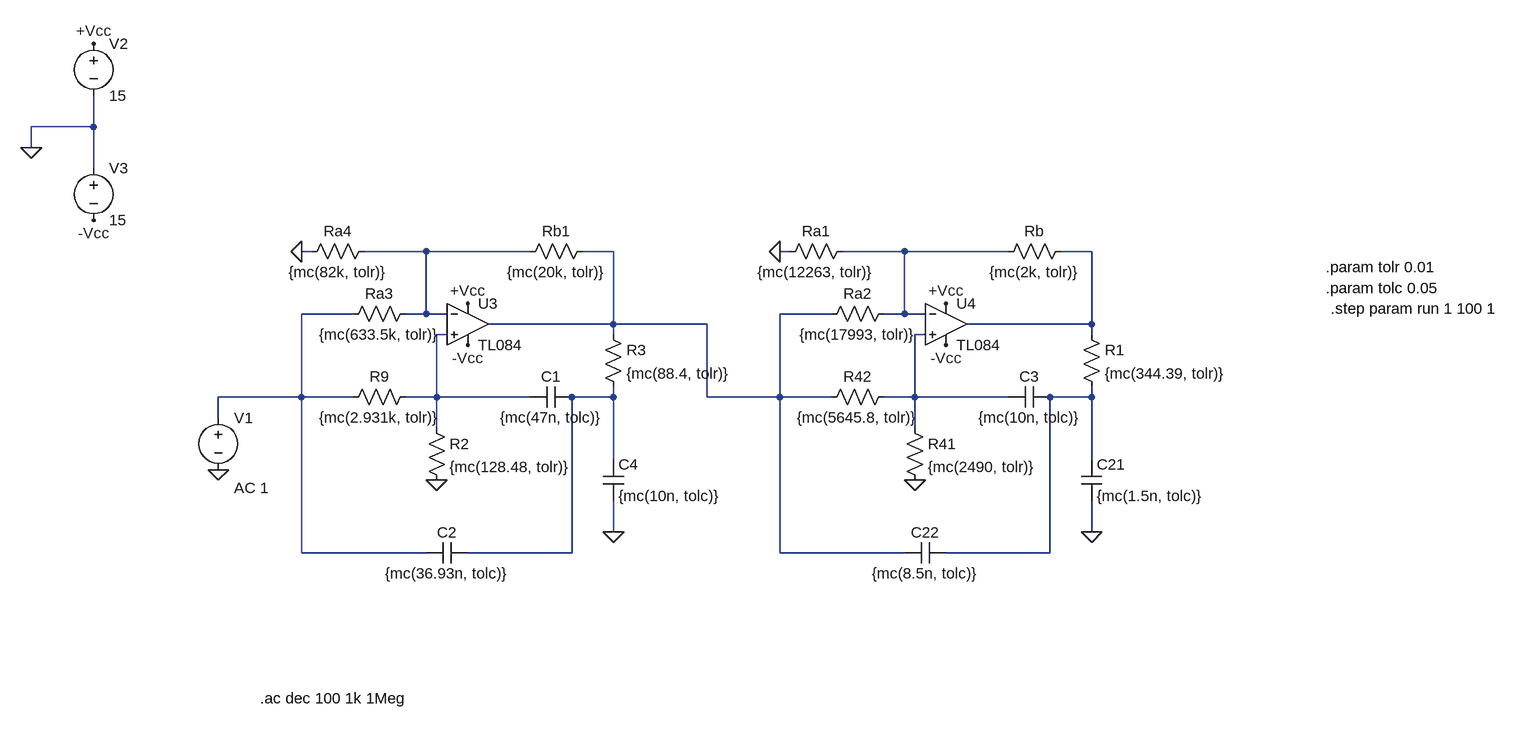
[diagram p0: schematic Sedra_double_Montecarlo.asc]
Sedra_double_Montecarlo.asc, the LTspice schematic file:
Version 4
SHEET 1 1996 680
WIRE -192 -480 -192 -528
WIRE -192 -480 -288 -480
WIRE -288 -448 -288 -480
WIRE -192 -416 -192 -480
WIRE 144 -288 128 -288
WIRE 320 -288 224 -288
WIRE 480 -288 320 -288
WIRE 608 -288 560 -288
WIRE 880 -288 864 -288
WIRE 1056 -288 960 -288
WIRE 1216 -288 1056 -288
WIRE 1344 -288 1296 -288
WIRE 208 -192 128 -192
WIRE 320 -192 320 -288
WIRE 320 -192 288 -192
WIRE 352 -192 320 -192
WIRE 944 -192 864 -192
WIRE 1056 -192 1056 -288
WIRE 1056 -192 1024 -192
WIRE 1088 -192 1056 -192
WIRE 608 -176 608 -288
WIRE 608 -176 416 -176
WIRE 752 -176 608 -176
WIRE 1344 -176 1344 -288
WIRE 1344 -176 1152 -176
WIRE 352 -160 336 -160
WIRE 608 -160 608 -176
WIRE 1088 -160 1072 -160
WIRE 1344 -160 1344 -176
WIRE 128 -64 128 -192
WIRE 128 -64 0 -64
WIRE 208 -64 128 -64
WIRE 336 -64 336 -160
WIRE 336 -64 288 -64
WIRE 480 -64 336 -64
WIRE 608 -64 608 -80
WIRE 608 -64 544 -64
WIRE 752 -64 752 -176
WIRE 864 -64 864 -192
WIRE 864 -64 752 -64
WIRE 944 -64 864 -64
WIRE 1072 -64 1072 -160
WIRE 1072 -64 1024 -64
WIRE 1216 -64 1072 -64
WIRE 1344 -64 1344 -80
WIRE 1344 -64 1280 -64
WIRE 0 -32 0 -64
WIRE 336 -16 336 -64
WIRE 1072 -16 1072 -64
WIRE 608 32 608 -64
WIRE 1344 32 1344 -64
WIRE 608 144 608 96
WIRE 1344 144 1344 96
WIRE 128 176 128 -64
WIRE 320 176 128 176
WIRE 544 176 544 -64
WIRE 544 176 384 176
WIRE 864 176 864 -64
WIRE 1056 176 864 176
WIRE 1280 176 1280 -64
WIRE 1280 176 1120 176
FLAG 0 48 0
FLAG 1072 64 0
FLAG 864 -288 0
FLAG 1344 144 0
FLAG -288 -448 0
FLAG 1120 -208 +Vcc
FLAG 1120 -144 -Vcc
FLAG -192 -608 +Vcc
FLAG -192 -336 -Vcc
FLAG 336 64 0
FLAG 128 -288 0
FLAG 608 144 0
FLAG 384 -208 +Vcc
FLAG 384 -144 -Vcc
SYMBOL voltage 0 -48 R0
WINDOW 123 24 124 Left 2
WINDOW 39 0 0 Left 0
SYMATTR Value2 AC 1
SYMATTR InstName V1
SYMATTR Value ""
SYMBOL res 1040 -80 R90
WINDOW 0 0 56 VBottom 2
WINDOW 3 32 56 VTop 2
SYMATTR InstName R42
SYMATTR Value {mc(5645.8, tolr)}
SYMBOL res 1040 -208 R90
WINDOW 0 0 56 VBottom 2
WINDOW 3 32 56 VTop 2
SYMATTR InstName Ra2
SYMATTR Value {mc(17993, tolr)}
SYMBOL res 1056 -32 R0
SYMATTR InstName R41
SYMATTR Value {mc(2490, tolr)}
SYMBOL cap 1280 -80 R90
WINDOW 0 0 32 VBottom 2
WINDOW 3 32 32 VTop 2
SYMATTR InstName C3
SYMATTR Value {mc(10n, tolc)}
SYMBOL cap 1120 160 R90
WINDOW 0 0 32 VBottom 2
WINDOW 3 32 32 VTop 2
SYMATTR InstName C22
SYMATTR Value {mc(8.5n, tolc)}
SYMBOL res 976 -304 R90
WINDOW 0 0 56 VBottom 2
WINDOW 3 32 56 VTop 2
SYMATTR InstName Ra1
SYMATTR Value {mc(12263, tolr)}
SYMBOL res 1312 -304 R90
WINDOW 0 0 56 VBottom 2
WINDOW 3 32 56 VTop 2
SYMATTR InstName Rb
SYMATTR Value {mc(2k, tolr)}
SYMBOL cap 1328 32 R0
SYMATTR InstName C21
SYMATTR Value {mc(1.5n, tolc)}
SYMBOL voltage -192 -624 R0
WINDOW 123 0 0 Left 0
WINDOW 39 0 0 Left 0
SYMATTR InstName V2
SYMATTR Value 15
SYMBOL voltage -192 -432 R0
WINDOW 123 0 0 Left 0
WINDOW 39 0 0 Left 0
SYMATTR InstName V3
SYMATTR Value 15
SYMBOL res 304 -80 R90
WINDOW 0 0 56 VBottom 2
WINDOW 3 32 56 VTop 2
SYMATTR InstName R9
SYMATTR Value {mc(2.931k, tolr)}
SYMBOL res 304 -208 R90
WINDOW 0 0 56 VBottom 2
WINDOW 3 32 56 VTop 2
SYMATTR InstName Ra3
SYMATTR Value {mc(633.5k, tolr)}
SYMBOL res 320 -32 R0
SYMATTR InstName R2
SYMATTR Value {mc(128.48, tolr)}
SYMBOL cap 544 -80 R90
WINDOW 0 0 32 VBottom 2
WINDOW 3 32 32 VTop 2
SYMATTR InstName C1
SYMATTR Value {mc(47n, tolc)}
SYMBOL cap 384 160 R90
WINDOW 0 0 32 VBottom 2
WINDOW 3 32 32 VTop 2
SYMATTR InstName C2
SYMATTR Value {mc(36.93n, tolc)}
SYMBOL res 240 -304 R90
WINDOW 0 0 56 VBottom 2
WINDOW 3 32 56 VTop 2
SYMATTR InstName Ra4
SYMATTR Value {mc(82k, tolr)}
SYMBOL res 576 -304 R90
WINDOW 0 0 56 VBottom 2
WINDOW 3 32 56 VTop 2
SYMATTR InstName Rb1
SYMATTR Value {mc(20k, tolr)}
SYMBOL cap 592 32 R0
SYMATTR InstName C4
SYMATTR Value {mc(10n, tolc)}
SYMBOL res 1328 -176 R0
SYMATTR InstName R1
SYMATTR Value {mc(344.39, tolr)}
SYMBOL res 592 -176 R0
SYMATTR InstName R3
SYMATTR Value {mc(88.4, tolr)}
SYMBOL sympropio\\TL084 384 -240 R0
SYMATTR InstName U3
SYMBOL sympropio\\TL084 1120 -240 R0
SYMATTR InstName U4
TEXT 64 400 Left 2 !.ac dec 100 1k 1Meg
TEXT 1704 -264 Left 2 !.param tolr 0.01
TEXT 1704 -232 Left 2 !.param tolc 0.05
TEXT 1712 -200 Left 2 !.step param run 1 100 1

The netlist it stands for:
* Sedra_double_Montecarlo.asc
V1 N005 0 AC 1
R42 N007 N002 {mc(5645.8, tolr)}
Ra2 N003 N002 {mc(17993, tolr)}
R41 N007 0 {mc(2490, tolr)}
C3 N009 N007 {mc(10n, tolc)}
C22 N009 N002 {mc(8.5n, tolc)}
Ra1 N003 0 {mc(12263, tolr)}
Rb N004 N003 {mc(2k, tolr)}
C21 N009 0 {mc(1.5n, tolc)}
V2 +Vcc 0 15
V3 0 -Vcc 15
R9 N006 N005 {mc(2.931k, tolr)}
Ra3 N001 N005 {mc(633.5k, tolr)}
R2 N006 0 {mc(128.48, tolr)}
C1 N008 N006 {mc(47n, tolc)}
C2 N008 N005 {mc(36.93n, tolc)}
Ra4 N001 0 {mc(82k, tolr)}
Rb1 N002 N001 {mc(20k, tolr)}
C4 N008 0 {mc(10n, tolc)}
R1 N004 N009 {mc(344.39, tolr)}
R3 N002 N008 {mc(88.4, tolr)}
* U3: TL084 (symbol sympropio\TL084 not available, pins judged from their places): In+=N006 In-=N001 V+=+Vcc V-=-Vcc OUT=N002
* U4: TL084 (symbol sympropio\TL084 not available, pins judged from their places): In+=N007 In-=N003 V+=+Vcc V-=-Vcc OUT=N004
.ac dec 100 1k 1Meg
.param tolr 0.01
.param tolc 0.05
.step param run 1 100 1
.backanno
.end